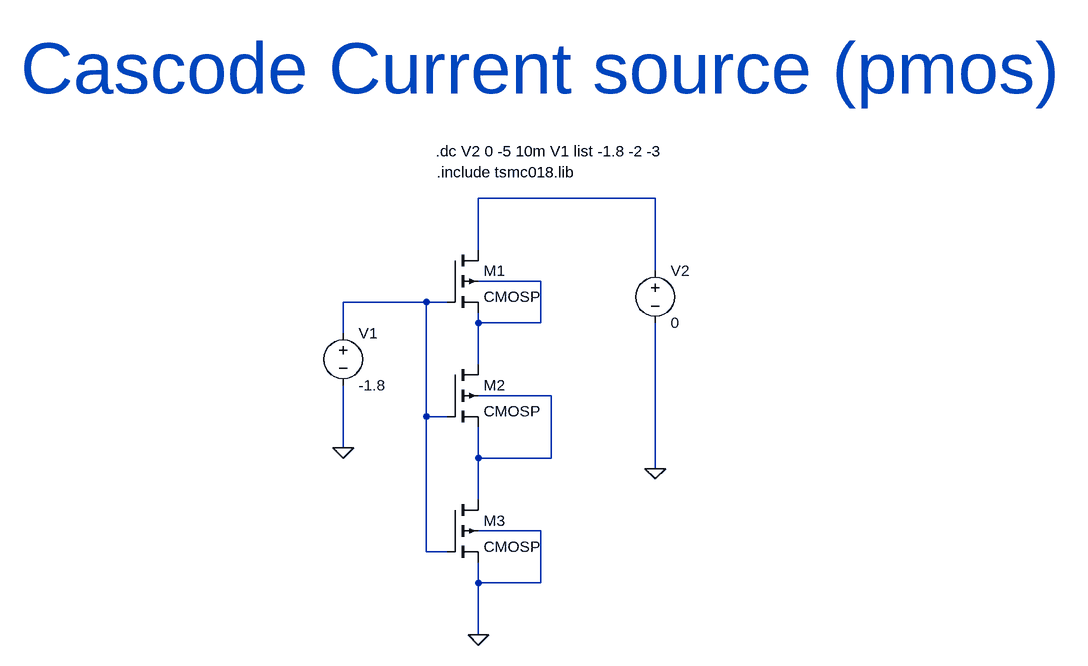
[diagram p0: schematic Cascode pmos current source.asc]
Cascode pmos current source.asc, the LTspice schematic file:
Version 4
SHEET 1 1724 932
WIRE 992 112 720 112
WIRE 720 192 720 112
WIRE 992 224 992 112
WIRE 816 240 720 240
WIRE 640 272 512 272
WIRE 672 272 640 272
WIRE 720 304 720 288
WIRE 816 304 816 240
WIRE 816 304 720 304
WIRE 512 320 512 272
WIRE 720 368 720 304
WIRE 832 416 720 416
WIRE 640 448 640 272
WIRE 672 448 640 448
WIRE 512 496 512 400
WIRE 720 512 720 464
WIRE 832 512 832 416
WIRE 832 512 720 512
WIRE 992 528 992 304
WIRE 720 576 720 512
WIRE 816 624 720 624
WIRE 640 656 640 448
WIRE 672 656 640 656
WIRE 720 704 720 672
WIRE 816 704 816 624
WIRE 816 704 720 704
WIRE 720 784 720 704
FLAG 512 496 0
FLAG 720 784 0
FLAG 992 528 0
SYMBOL cmosp 672 192 R0
SYMATTR InstName M1
SYMATTR Value2 l=1u w=5u
SYMBOL voltage 512 304 R0
WINDOW 123 0 0 Left 2
WINDOW 39 0 0 Left 2
SYMATTR InstName V1
SYMATTR Value -1.8
SYMBOL cmosp 672 368 R0
SYMATTR InstName M2
SYMATTR Value2 l=1u w=5u
SYMBOL cmosp 672 576 R0
SYMATTR InstName M3
SYMATTR Value2 l=1u w=5u
SYMBOL voltage 992 208 R0
WINDOW 123 0 0 Left 2
WINDOW 39 0 0 Left 2
SYMATTR InstName V2
SYMATTR Value 0
TEXT 656 72 Left 2 !.include tsmc018.lib
TEXT 654 40 Left 2 !.dc V2 0 -5 10m V1 list -1.8 -2 -3
TEXT 16 -88 Left 7 ;Cascode Current source (pmos)

The netlist it stands for:
* Cascode pmos current source.asc
M1 N001 N003 N002 N002 CMOSP l=1u w=5u
V1 N003 0 -1.8
M2 N002 N003 N004 N004 CMOSP l=1u w=5u
M3 N004 N003 0 0 CMOSP l=1u w=5u
V2 N001 0 0
.model NMOS NMOS
.model PMOS PMOS
.lib standard.mos
.include tsmc018.lib
.dc V2 0 -5 10m V1 list -1.8 -2 -3
* Cascode Current source (pmos)
.backanno
.end